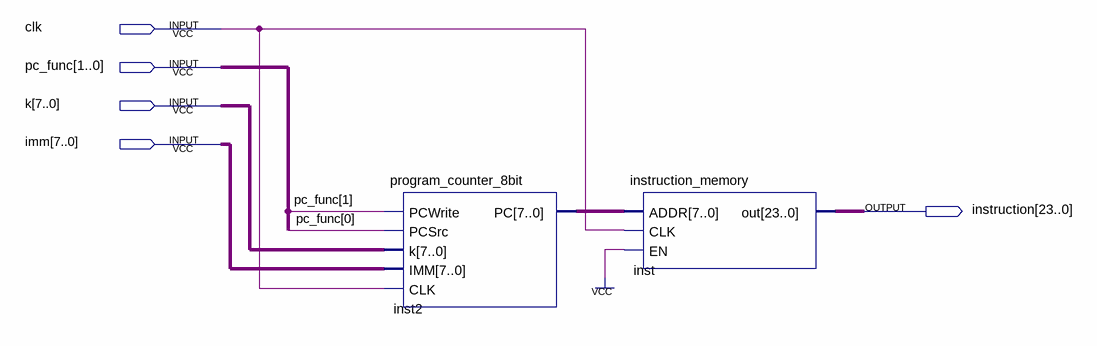
[diagram p0: schematic sheet]
// Quartus schematic pc_plus_inscruction_memory.bdf as structural Verilog: 2 symbols, 5 pins
module pc_plus_inscruction_memory (
  input  clk,
  input  [1:0] pc_func,
  input  [7:0] k,
  input  [7:0] imm,
  output [23:0] instruction
);

  wire [7:0] inst2_pc;

  program_counter_8bit inst2 (.PCWrite(pc_func[1]), .PCSrc(pc_func[0]), .k(k), .IMM(imm), .CLK(clk), .PC(inst2_pc));
  instruction_memory inst (.ADDR(inst2_pc), .CLK(clk), .EN(1'b1), .out(instruction));
endmodule
